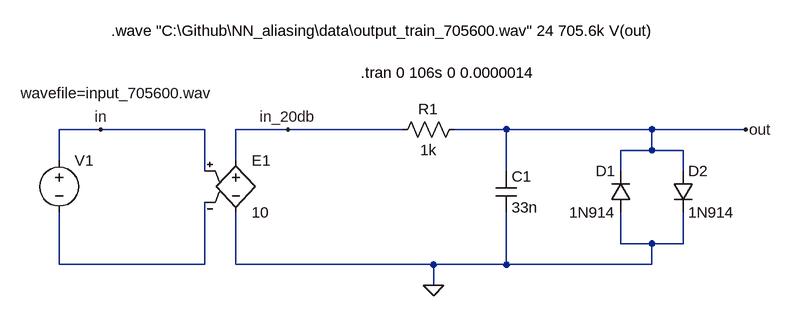
[diagram p0: schematic Test_Passive_Diode_Clipper.asc]
Test_Passive_Diode_Clipper.asc, the LTspice schematic file:
Version 4
SHEET 1 944 680
WIRE -288 48 -352 48
WIRE -128 48 -288 48
WIRE 0 48 -80 48
WIRE 176 48 0 48
WIRE 336 48 256 48
WIRE 560 48 336 48
WIRE 704 48 560 48
WIRE 560 80 560 48
WIRE 560 80 512 80
WIRE 608 80 560 80
WIRE -352 96 -352 48
WIRE -80 96 -80 48
WIRE -128 112 -128 48
WIRE 336 112 336 48
WIRE 512 112 512 80
WIRE 608 112 608 80
WIRE 512 224 512 176
WIRE 560 224 512 224
WIRE 608 224 608 176
WIRE 608 224 560 224
WIRE -352 256 -352 176
WIRE -128 256 -128 160
WIRE -128 256 -352 256
WIRE -80 256 -80 176
WIRE 224 256 -80 256
WIRE 336 256 336 176
WIRE 336 256 224 256
WIRE 560 256 560 224
WIRE 560 256 336 256
WIRE 224 288 224 256
FLAG 224 288 0
FLAG 704 48 out
FLAG -288 48 in
FLAG 0 48 in_20db
SYMBOL voltage -352 80 R0
WINDOW 3 -59 -88 Left 2
SYMATTR Value wavefile=input_705600.wav
SYMATTR InstName V1
SYMBOL res 272 32 R90
WINDOW 0 0 56 VBottom 2
WINDOW 3 32 56 VTop 2
SYMATTR InstName R1
SYMATTR Value 1k
SYMBOL cap 320 112 R0
SYMATTR InstName C1
SYMATTR Value 33n
SYMBOL diode 528 176 R180
WINDOW 0 24 64 Left 2
WINDOW 3 24 0 Left 2
SYMATTR InstName D1
SYMATTR Value 1N914
SYMBOL diode 592 112 R0
SYMATTR InstName D2
SYMATTR Value 1N914
SYMBOL e -80 80 R0
SYMATTR InstName E1
SYMATTR Value 10
TEXT 112 -40 Left 2 !.tran 0 106s 0 0.0000014
TEXT -272 -104 Left 2 !.wave "C:\\Github\\NN_aliasing\\data\\output_train_705600.wav" 24 705.6k V(out)

The netlist it stands for:
* Test_Passive_Diode_Clipper.asc
V1 in N001 wavefile=input_705600.wav
R1 out in_20db 1k
C1 out 0 33n
D1 0 out 1N914
D2 out 0 1N914
E1 in_20db 0 in N001 10
.model D D
.lib standard.dio
.tran 0 106s 0 0.0000014
.wave "C:\Github\NN_aliasing\data\output_train_705600.wav" 24 705.6k V(out)
.backanno
.end